# EAGLE schematic YutaAndJialiang v17 (EAGLE 9.7.0)
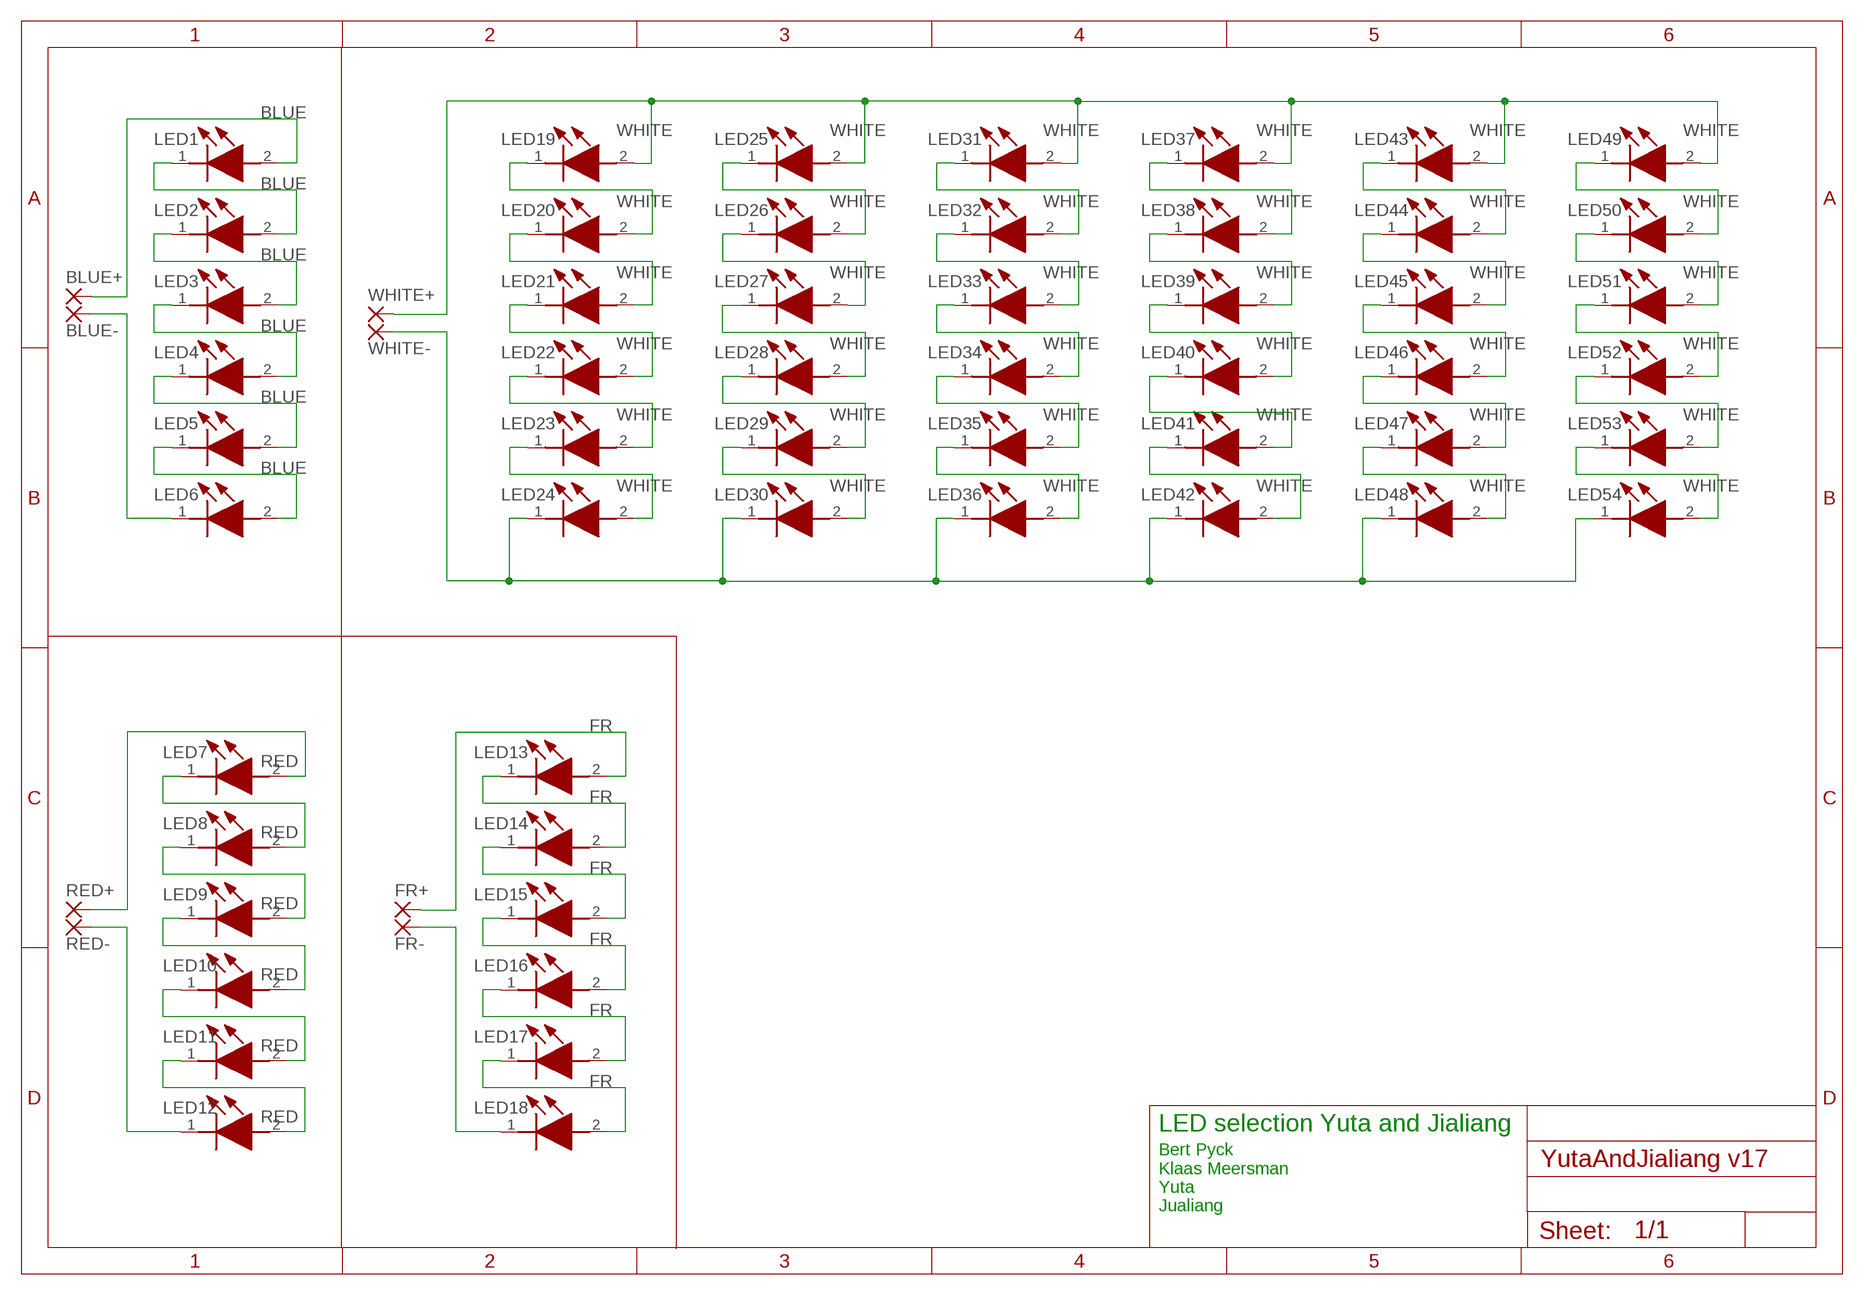
[diagram p0: schematic, sheet 1]

## Parts
BLUE+  SOLDERPAD  [SOLDERPAD]
BLUE-  SOLDERPAD  [SOLDERPAD]
FR+  SOLDERPAD  [SOLDERPAD]
FR-  SOLDERPAD  [SOLDERPAD]
LED1  BLUE  [L1SP-PNK1002800000]
LED2  BLUE  [L1SP-PNK1002800000]
LED3  BLUE  [L1SP-PNK1002800000]
LED4  BLUE  [L1SP-PNK1002800000]
LED5  BLUE  [L1SP-PNK1002800000]
LED6  BLUE  [L1SP-PNK1002800000]
LED7  RED  [L1SP-PNK1002800000]
LED8  RED  [L1SP-PNK1002800000]
LED9  RED  [L1SP-PNK1002800000]
LED10  RED  [L1SP-PNK1002800000]
LED11  RED  [L1SP-PNK1002800000]
LED12  RED  [L1SP-PNK1002800000]
LED13  FR  [L1SP-PNK1002800000]
LED14  FR  [L1SP-PNK1002800000]
LED15  FR  [L1SP-PNK1002800000]
LED16  FR  [L1SP-PNK1002800000]
LED17  FR  [L1SP-PNK1002800000]
LED18  FR  [L1SP-PNK1002800000]
LED19  WHITE  [L1SP-PNK1002800000]
LED20  WHITE  [L1SP-PNK1002800000]
LED21  WHITE  [L1SP-PNK1002800000]
LED22  WHITE  [L1SP-PNK1002800000]
LED23  WHITE  [L1SP-PNK1002800000]
LED24  WHITE  [L1SP-PNK1002800000]
LED25  WHITE  [L1SP-PNK1002800000]
LED26  WHITE  [L1SP-PNK1002800000]
LED27  WHITE  [L1SP-PNK1002800000]
LED28  WHITE  [L1SP-PNK1002800000]
LED29  WHITE  [L1SP-PNK1002800000]
LED30  WHITE  [L1SP-PNK1002800000]
LED31  WHITE  [L1SP-PNK1002800000]
LED32  WHITE  [L1SP-PNK1002800000]
LED33  WHITE  [L1SP-PNK1002800000]
LED34  WHITE  [L1SP-PNK1002800000]
LED35  WHITE  [L1SP-PNK1002800000]
LED36  WHITE  [L1SP-PNK1002800000]
LED37  WHITE  [L1SP-PNK1002800000]
LED38  WHITE  [L1SP-PNK1002800000]
LED39  WHITE  [L1SP-PNK1002800000]
LED40  WHITE  [L1SP-PNK1002800000]
LED41  WHITE  [L1SP-PNK1002800000]
LED42  WHITE  [L1SP-PNK1002800000]
LED43  WHITE  [L1SP-PNK1002800000]
LED44  WHITE  [L1SP-PNK1002800000]
LED45  WHITE  [L1SP-PNK1002800000]
LED46  WHITE  [L1SP-PNK1002800000]
LED47  WHITE  [L1SP-PNK1002800000]
LED48  WHITE  [L1SP-PNK1002800000]
LED49  WHITE  [L1SP-PNK1002800000]
LED50  WHITE  [L1SP-PNK1002800000]
LED51  WHITE  [L1SP-PNK1002800000]
LED52  WHITE  [L1SP-PNK1002800000]
LED53  WHITE  [L1SP-PNK1002800000]
LED54  WHITE  [L1SP-PNK1002800000]
RED+  SOLDERPAD  [SOLDERPAD]
RED-  SOLDERPAD  [SOLDERPAD]
WHITE+  SOLDERPAD  [SOLDERPAD]
WHITE-  SOLDERPAD  [SOLDERPAD]

## Nets
N$1: LED7.2(A) RED+.1(P)
N$2: LED28.1(K) LED29.2(A)
N$3: LED7.1(K) LED8.2(A)
N$4: LED8.1(K) LED9.2(A)
N$5: LED9.1(K) LED10.2(A)
N$6: LED10.1(K) LED11.2(A)
N$7: LED11.1(K) LED12.2(A)
N$8: BLUE-.1(P) LED6.1(K)
N$9: FR+.1(P) LED13.2(A)
N$10: LED19.2(A) LED25.2(A) LED31.2(A) LED37.2(A) LED43.2(A) LED49.2(A) WHITE+.1(P)
N$11: LED24.1(K) LED30.1(K) LED36.1(K) LED42.1(K) LED48.1(K) LED54.1(K) WHITE-.1(P)
N$12: LED19.1(K) LED20.2(A)
N$13: LED29.1(K) LED30.2(A)
N$14: LED20.1(K) LED21.2(A)
N$15: LED21.1(K) LED22.2(A)
N$16: LED22.1(K) LED23.2(A)
N$17: LED13.1(K) LED14.2(A)
N$18: LED14.1(K) LED15.2(A)
N$19: LED15.1(K) LED16.2(A)
N$20: LED16.1(K) LED17.2(A)
N$21: LED17.1(K) LED18.2(A)
N$22: LED23.1(K) LED24.2(A)
N$23: FR-.1(P) LED18.1(K)
N$24: LED25.1(K) LED26.2(A)
N$25: LED26.1(K) LED27.2(A)
N$26: LED27.1(K) LED28.2(A)
N$27: LED12.1(K) RED-.1(P)
N$31: LED31.1(K) LED32.2(A)
N$33: LED32.1(K) LED33.2(A)
N$35: BLUE+.1(P) LED1.2(A)
N$36: LED1.1(K) LED2.2(A)
N$37: LED2.1(K) LED3.2(A)
N$38: LED3.1(K) LED4.2(A)
N$39: LED4.1(K) LED5.2(A)
N$40: LED5.1(K) LED6.2(A)
N$41: LED33.1(K) LED34.2(A)
N$42: LED34.1(K) LED35.2(A)
N$43: LED35.1(K) LED36.2(A)
N$45: LED37.1(K) LED38.2(A)
N$46: LED38.1(K) LED39.2(A)
N$47: LED39.1(K) LED40.2(A)
N$48: LED40.1(K) LED41.2(A)
N$49: LED41.1(K) LED42.2(A)
N$51: LED43.1(K) LED44.2(A)
N$53: LED44.1(K) LED45.2(A)
N$54: LED45.1(K) LED46.2(A)
N$55: LED46.1(K) LED47.2(A)
N$56: LED47.1(K) LED48.2(A)
N$58: LED49.1(K) LED50.2(A)
N$59: LED50.1(K) LED51.2(A)
N$60: LED51.1(K) LED52.2(A)
N$61: LED52.1(K) LED53.2(A)
N$62: LED53.1(K) LED54.2(A)

## Notes on the sheet
- LED selection Yuta and Jialiang
- Bert Pyck
  Klaas Meersman
  Yuta
  Jualiang

## Library data of the parts
BLUE+ BLUE- FR+ FR- RED+ RED- WHITE+ WHITE- = LibraryLEDs:SOLDERPAD: SMD PAD
LED1-LED6 = Luxeon SunPlus 2835:BLUE: Royal Blue 440-455nm Source: Datasheet <https://otmm.lumileds.com/adaptivemedia/f0665283471a2a639ce8c3006456265ad074bde9>; DESCRIPTION: High Power LEDs - Single Color 2835 Mid-Power ColorFar Red 720-740nm; HEIGHT: mm; MANUFACTURER_NAME: CREE LED; MANUFACTURER_PART_NUMBER: JE2835AFR-N-0001A0000-N0000001; MOUSER_PART_NUMBER: 941-JE2835AFRN01AN; MOUSER_PRICE-STOCK: https://www.mouser.co.uk/ProductDetail/Cree-LED/JE2835AFR-N-0001A0000-N0000001?qs=tlsG%2FOw5FFhxeS5Ond46kw%3D%3D
LED7-LED12 = Luxeon SunPlus 2835:RED: Deep Red 650-670nm Source: Datasheet <https://otmm.lumileds.com/adaptivemedia/f0665283471a2a639ce8c3006456265ad074bde9>; DESCRIPTION: High Power LEDs - Single Color 2835 Mid-Power ColorFar Red 720-740nm; HEIGHT: mm; MANUFACTURER_NAME: CREE LED; MANUFACTURER_PART_NUMBER: JE2835AFR-N-0001A0000-N0000001; MOUSER_PART_NUMBER: 941-JE2835AFRN01AN; MOUSER_PRICE-STOCK: https://www.mouser.co.uk/ProductDetail/Cree-LED/JE2835AFR-N-0001A0000-N0000001?qs=tlsG%2FOw5FFhxeS5Ond46kw%3D%3D
LED13-LED18 = Luxeon SunPlus 2835:FR: Far Red 720-740nm Source: Datasheet <https://otmm.lumileds.com/adaptivemedia/f0665283471a2a639ce8c3006456265ad074bde9>; DESCRIPTION: High Power LEDs - Single Color 2835 Mid-Power ColorFar Red 720-740nm; HEIGHT: mm; MANUFACTURER_NAME: CREE LED; MANUFACTURER_PART_NUMBER: JE2835AFR-N-0001A0000-N0000001; MOUSER_PART_NUMBER: 941-JE2835AFRN01AN; MOUSER_PRICE-STOCK: https://www.mouser.co.uk/ProductDetail/Cree-LED/JE2835AFR-N-0001A0000-N0000001?qs=tlsG%2FOw5FFhxeS5Ond46kw%3D%3D
LED19-LED54 = Luxeon SunPlus 2835:WHITE: Horticulture White Source: Datasheet <https://otmm.lumileds.com/adaptivemedia/f0665283471a2a639ce8c3006456265ad074bde9>; DESCRIPTION: High Power LEDs - Single Color 2835 Mid-Power ColorFar Red 720-740nm; HEIGHT: mm; MANUFACTURER_NAME: CREE LED; MANUFACTURER_PART_NUMBER: JE2835AFR-N-0001A0000-N0000001; MOUSER_PART_NUMBER: 941-JE2835AFRN01AN; MOUSER_PRICE-STOCK: https://www.mouser.co.uk/ProductDetail/Cree-LED/JE2835AFR-N-0001A0000-N0000001?qs=tlsG%2FOw5FFhxeS5Ond46kw%3D%3D

## Net classes
0 default: width 0.5 mm, drill 0.3 mm, clearance 0.1 mm